# Altium schematic sheet Gate Driver Chip.SchDoc
size A4; SheetNumber: 7; SheetTotal: 7
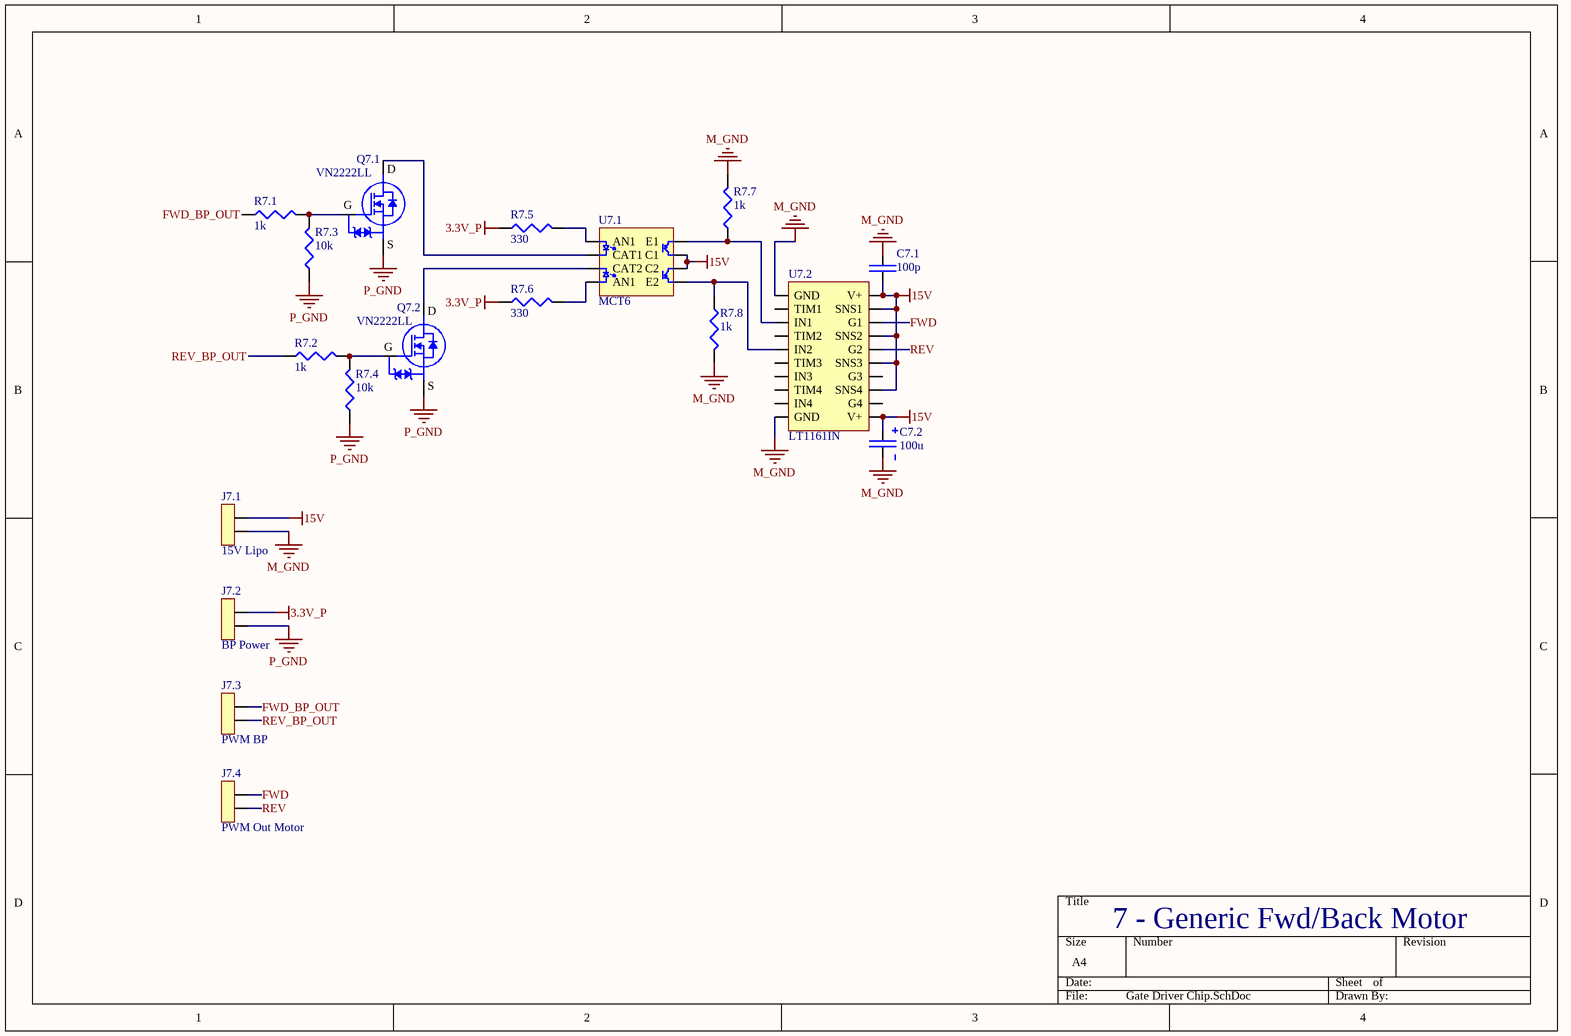
[diagram p0: Gate Driver Chip.SchDoc]

## Parts
C7.1  100p  [Non Polarized Cap]
C7.2  100u  [Polarized Cap]
J7.1  15V Lipo  [2pos JST]
J7.2  BP Power  [2pos JST]
J7.3  PWM BP  [2pos JST]
J7.4  PWM Out Motor  [2pos JST]
Q7.1  VN2222LL  [VN2222LL]
Q7.2  VN2222LL  [VN2222LL]
R7.1  1k  [Res_Generic]
R7.2  1k  [Res_Generic]
R7.3  10k  [Res_Generic]
R7.4  10k  [Res_Generic]
R7.5  330  [Res_Generic]
R7.6  330  [Res_Generic]
R7.7  1k  [Res_Generic]
R7.8  1k  [Res_Generic]
U7.1  MCT6  [DIP8]
U7.2  LT1161IN  [DIP20]

## Nets
3.3V_P: J7.2.2 R7.5.1 R7.6.1
15V: C7.1.1 C7.2.1 J7.1.2 U7.1.6(C2) U7.1.7(C1) U7.2.11(V+) U7.2.13(SNS4) U7.2.15(SNS3) U7.2.17(SNS2) U7.2.19(SNS1) U7.2.20(V+)
M_GND: C7.1.2 C7.2.2 J7.1.1 R7.7.2 R7.8.2 U7.2.1(GND) U7.2.10(GND)
P_GND: J7.2.1 Q7.1.1(S) Q7.2.1(S) R7.3.1 R7.4.1
FWD: J7.4.2 U7.2.18(G1)
FWD_BP_OUT: J7.3.2 R7.1.1
REV: J7.4.1 U7.2.16(G2)
REV_BP_OUT: J7.3.1 R7.2.1
NetQ7.1_2: Q7.1.2(G) R7.1.2 R7.3.2
NetQ7.1_3: Q7.1.3(D) U7.1.2(CAT1)
NetQ7.2_2: Q7.2.2(G) R7.2.2 R7.4.2
NetQ7.2_3: Q7.2.3(D) U7.1.3(CAT2)
NetR7.5_2: R7.5.2 U7.1.1(AN1)
NetR7.6_2: R7.6.2 U7.1.4(AN1)
NetR7.7_1: R7.7.1 U7.1.8(E1) U7.2.3(IN1)
NetR7.8_1: R7.8.1 U7.1.5(E2) U7.2.5(IN2)

Not connected (* = marked no-connect by the designer): U7.2 2(TIM1) 4(TIM2) 6(TIM3) 7(IN3) 8(TIM4) 9(IN4) 12(G4) 14(G3)

## Notes on the sheet
- 7 - Generic Fwd/Back Motor

## Library data of the parts
C7.1 = Cap_Generic
C7.2 = Polarized Cap
J7.1-J7.4 = 2pos Conn: 2pos Conn JST
Q7.1 Q7.2 = VN2222LL NMOS: VN2222LL N-Channel 60 V 150mA 400mW Through Hole TO-92 (TO-226); Supplier 1: Mouser; Supplier Part Number 1: 689-VN2222LL-G
R7.1-R7.8 = Res_Generic
U7.1 = MCT6 Optocoupler: Optoisolator 5.3KV 2CH TRANS 8-DIP; Supplier 1: Mouser; Supplier Part Number 1: 512-MCT6
U7.2 = LT1161IN Gate Driver: LT1161IN High-Side Gate Driver IC Non-Inverting 20-PDIP; Supplier 1: Digi-Key; Supplier Part Number 1: LT1161IN#PBF-ND